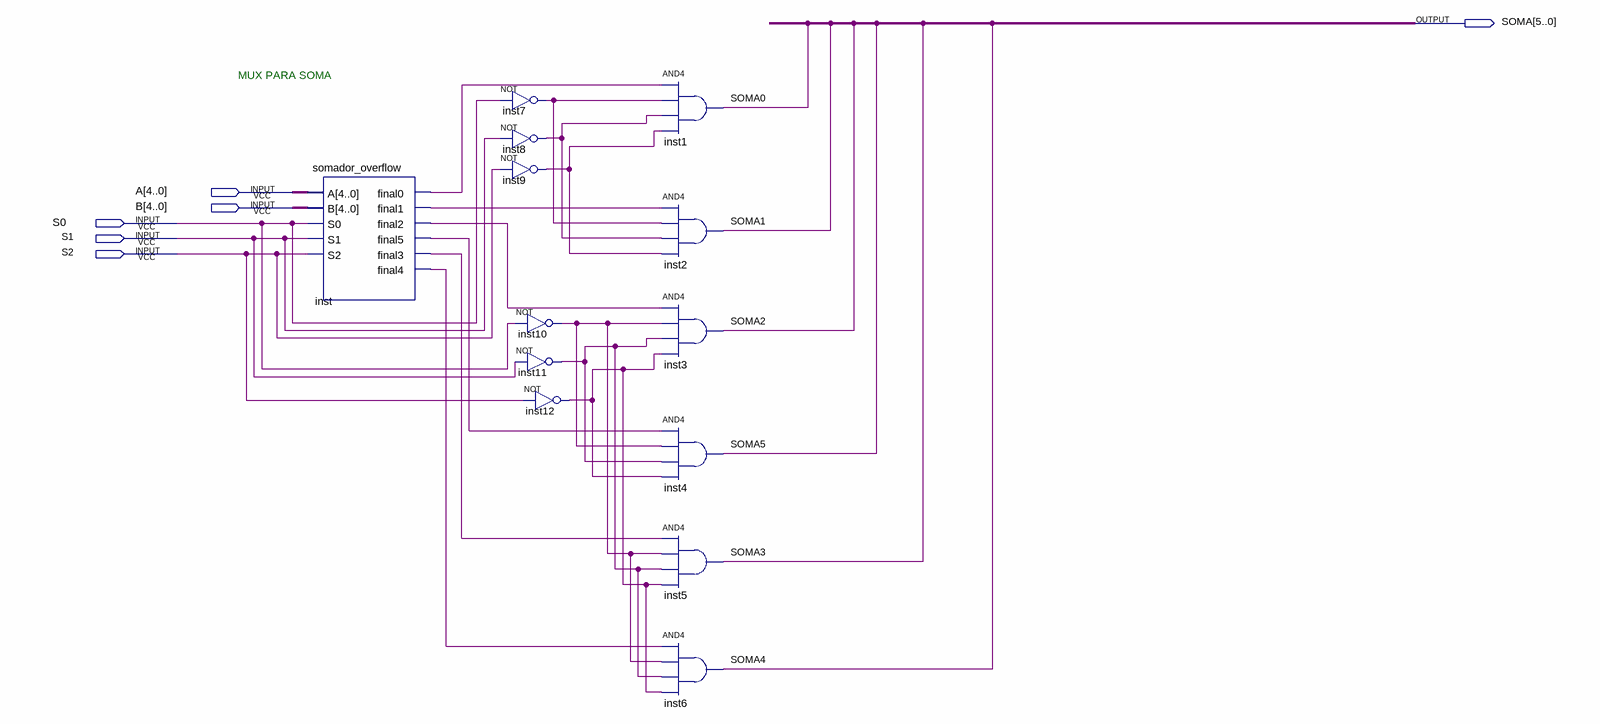
[diagram p0: schematic sheet]
// Quartus schematic MUX_SOMA.bdf as structural Verilog: 13 symbols, 6 pins
module MUX_SOMA (
  input  [4:0] A,
  input  [4:0] B,
  input  S0,
  input  S1,
  input  S2,
  output [5:0] SOMA
);

  wire inst7_out, inst8_out, inst9_out, inst10_out, inst11_out, inst12_out, inst_final0, inst_final1,
       inst_final2, inst_final3, inst_final4, inst_final5;

  somador_overflow inst (
    .A(A), .B(B), .S0(S0), .S1(S1), .S2(S2), .final0(inst_final0), .final1(inst_final1),
    .final2(inst_final2), .final5(inst_final5), .final3(inst_final3), .final4(inst_final4));
  not inst7 (inst7_out, S0);
  not inst8 (inst8_out, S1);
  not inst9 (inst9_out, S2);
  not inst10 (inst10_out, S0);
  not inst11 (inst11_out, S1);
  not inst12 (inst12_out, S2);
  and inst1 (SOMA[0], inst_final0, inst7_out, inst8_out, inst9_out);
  and inst2 (SOMA[1], inst_final1, inst7_out, inst8_out, inst9_out);
  and inst3 (SOMA[2], inst_final2, inst10_out, inst11_out, inst12_out);
  and inst4 (SOMA[5], inst_final5, inst10_out, inst11_out, inst12_out);
  and inst5 (SOMA[3], inst_final3, inst10_out, inst11_out, inst12_out);
  and inst6 (SOMA[4], inst_final4, inst10_out, inst11_out, inst12_out);

  // Notes on the sheet:
  //   MUX PARA SOMA
endmodule
